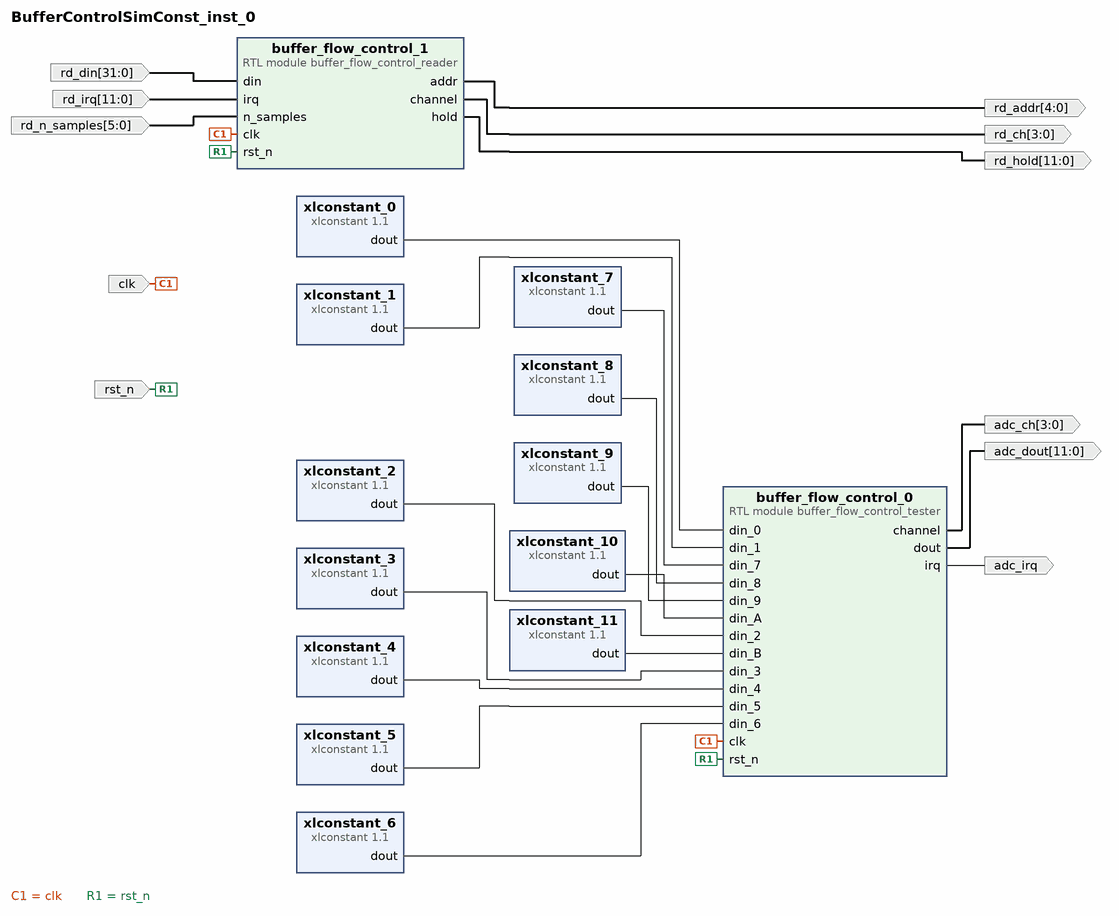
[diagram p0: block diagram of the top level]
# Vivado block design BufferControlSimConst_inst_0, xczu3eg-sbva484-1-i, Vivado 2020.2
create_bd_design BufferControlSimConst_inst_0

create_bd_port -dir O -from 3 -to 0 adc_ch
create_bd_port -dir O -from 11 -to 0 adc_dout
create_bd_port -dir O -type intr adc_irq
create_bd_port -dir I -type clk clk
create_bd_port -dir O -from 4 -to 0 rd_addr
create_bd_port -dir O -from 3 -to 0 rd_ch
create_bd_port -dir I -from 31 -to 0 rd_din
create_bd_port -dir O -from 11 -to 0 rd_hold
create_bd_port -dir I -from 11 -to 0 -type intr rd_irq
create_bd_port -dir I -from 5 -to 0 rd_n_samples
create_bd_port -dir I -type rst rst_n

create_bd_cell -type module -reference buffer_flow_control_tester buffer_flow_control_0
create_bd_cell -type ip -vlnv xilinx.com:ip:xlconstant:1.1 xlconstant_0
set_property -dict {CONFIG.CONST_VAL 111 CONFIG.CONST_WIDTH 12} [get_bd_cells xlconstant_0]
create_bd_cell -type ip -vlnv xilinx.com:ip:xlconstant:1.1 xlconstant_1
set_property -dict {CONFIG.CONST_VAL 222 CONFIG.CONST_WIDTH 12} [get_bd_cells xlconstant_1]
create_bd_cell -type ip -vlnv xilinx.com:ip:xlconstant:1.1 xlconstant_2
set_property -dict {CONFIG.CONST_VAL 333 CONFIG.CONST_WIDTH 12} [get_bd_cells xlconstant_2]
create_bd_cell -type ip -vlnv xilinx.com:ip:xlconstant:1.1 xlconstant_3
set_property -dict {CONFIG.CONST_VAL 444 CONFIG.CONST_WIDTH 12} [get_bd_cells xlconstant_3]
create_bd_cell -type ip -vlnv xilinx.com:ip:xlconstant:1.1 xlconstant_4
set_property -dict {CONFIG.CONST_VAL 555 CONFIG.CONST_WIDTH 12} [get_bd_cells xlconstant_4]
create_bd_cell -type ip -vlnv xilinx.com:ip:xlconstant:1.1 xlconstant_5
set_property -dict {CONFIG.CONST_VAL 666 CONFIG.CONST_WIDTH 12} [get_bd_cells xlconstant_5]
create_bd_cell -type ip -vlnv xilinx.com:ip:xlconstant:1.1 xlconstant_6
set_property -dict {CONFIG.CONST_VAL 777 CONFIG.CONST_WIDTH 12} [get_bd_cells xlconstant_6]
create_bd_cell -type ip -vlnv xilinx.com:ip:xlconstant:1.1 xlconstant_7
set_property -dict {CONFIG.CONST_VAL 888 CONFIG.CONST_WIDTH 12} [get_bd_cells xlconstant_7]
create_bd_cell -type ip -vlnv xilinx.com:ip:xlconstant:1.1 xlconstant_8
set_property -dict {CONFIG.CONST_VAL 999 CONFIG.CONST_WIDTH 12} [get_bd_cells xlconstant_8]
create_bd_cell -type ip -vlnv xilinx.com:ip:xlconstant:1.1 xlconstant_9
set_property -dict {CONFIG.CONST_VAL 1000 CONFIG.CONST_WIDTH 12} [get_bd_cells xlconstant_9]
create_bd_cell -type ip -vlnv xilinx.com:ip:xlconstant:1.1 xlconstant_10
set_property -dict {CONFIG.CONST_VAL 1100 CONFIG.CONST_WIDTH 12} [get_bd_cells xlconstant_10]
create_bd_cell -type ip -vlnv xilinx.com:ip:xlconstant:1.1 xlconstant_11
set_property -dict {CONFIG.CONST_VAL 1200 CONFIG.CONST_WIDTH 12} [get_bd_cells xlconstant_11]
create_bd_cell -type module -reference buffer_flow_control_reader buffer_flow_control_1

# ---- connections ----

connect_bd_net [get_bd_pins buffer_flow_control_0/channel] [get_bd_ports adc_ch]
connect_bd_net [get_bd_pins buffer_flow_control_0/dout] [get_bd_ports adc_dout]
connect_bd_net [get_bd_pins buffer_flow_control_0/irq] [get_bd_ports adc_irq]
connect_bd_net [get_bd_pins buffer_flow_control_1/addr] [get_bd_ports rd_addr]
connect_bd_net [get_bd_pins buffer_flow_control_1/channel] [get_bd_ports rd_ch]
connect_bd_net [get_bd_pins buffer_flow_control_1/hold] [get_bd_ports rd_hold]
connect_bd_net -net clk_0_1 [get_bd_ports clk] [get_bd_pins buffer_flow_control_0/clk] [get_bd_pins buffer_flow_control_1/clk]
connect_bd_net -net din_0_1 [get_bd_ports rd_din] [get_bd_pins buffer_flow_control_1/din]
connect_bd_net -net irq_0_1 [get_bd_ports rd_irq] [get_bd_pins buffer_flow_control_1/irq]
connect_bd_net -net n_samples_0_1 [get_bd_ports rd_n_samples] [get_bd_pins buffer_flow_control_1/n_samples]
connect_bd_net -net rst_n_0_1 [get_bd_ports rst_n] [get_bd_pins buffer_flow_control_0/rst_n] [get_bd_pins buffer_flow_control_1/rst_n]
connect_bd_net [get_bd_pins xlconstant_0/dout] [get_bd_pins buffer_flow_control_0/din_0]
connect_bd_net [get_bd_pins xlconstant_1/dout] [get_bd_pins buffer_flow_control_0/din_1]
connect_bd_net [get_bd_pins xlconstant_2/dout] [get_bd_pins buffer_flow_control_0/din_2]
connect_bd_net [get_bd_pins xlconstant_3/dout] [get_bd_pins buffer_flow_control_0/din_3]
connect_bd_net [get_bd_pins xlconstant_4/dout] [get_bd_pins buffer_flow_control_0/din_4]
connect_bd_net [get_bd_pins xlconstant_5/dout] [get_bd_pins buffer_flow_control_0/din_5]
connect_bd_net [get_bd_pins xlconstant_6/dout] [get_bd_pins buffer_flow_control_0/din_6]
connect_bd_net [get_bd_pins xlconstant_7/dout] [get_bd_pins buffer_flow_control_0/din_7]
connect_bd_net [get_bd_pins xlconstant_8/dout] [get_bd_pins buffer_flow_control_0/din_8]
connect_bd_net [get_bd_pins xlconstant_9/dout] [get_bd_pins buffer_flow_control_0/din_9]
connect_bd_net [get_bd_pins xlconstant_10/dout] [get_bd_pins buffer_flow_control_0/din_A]
connect_bd_net [get_bd_pins xlconstant_11/dout] [get_bd_pins buffer_flow_control_0/din_B]

validate_bd_design
save_bd_design
